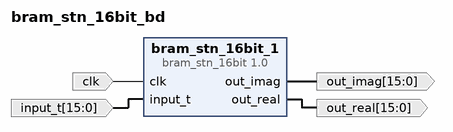
[diagram p0: block diagram of the top level]
# Vivado block design bram_stn_16bit_bd, xc7z020clg484-1, Vivado 2021.1
create_bd_design bram_stn_16bit_bd

create_bd_port -dir I -type clk clk
create_bd_port -dir I -from 15 -to 0 -type data input_t
create_bd_port -dir O -from 15 -to 0 -type data out_imag
create_bd_port -dir O -from 15 -to 0 -type data out_real

create_bd_cell -type ip -vlnv User_Company:SysGen:bram_stn_16bit:1.0 bram_stn_16bit_1

# ---- connections ----

connect_bd_net [get_bd_pins bram_stn_16bit_1/out_imag] [get_bd_ports out_imag]
connect_bd_net [get_bd_pins bram_stn_16bit_1/out_real] [get_bd_ports out_real]
connect_bd_net [get_bd_ports clk] [get_bd_pins bram_stn_16bit_1/clk]
connect_bd_net [get_bd_ports input_t] [get_bd_pins bram_stn_16bit_1/input_t]

validate_bd_design
save_bd_design
